# EAGLE schematic line_sensing (EAGLE 8.6.0)
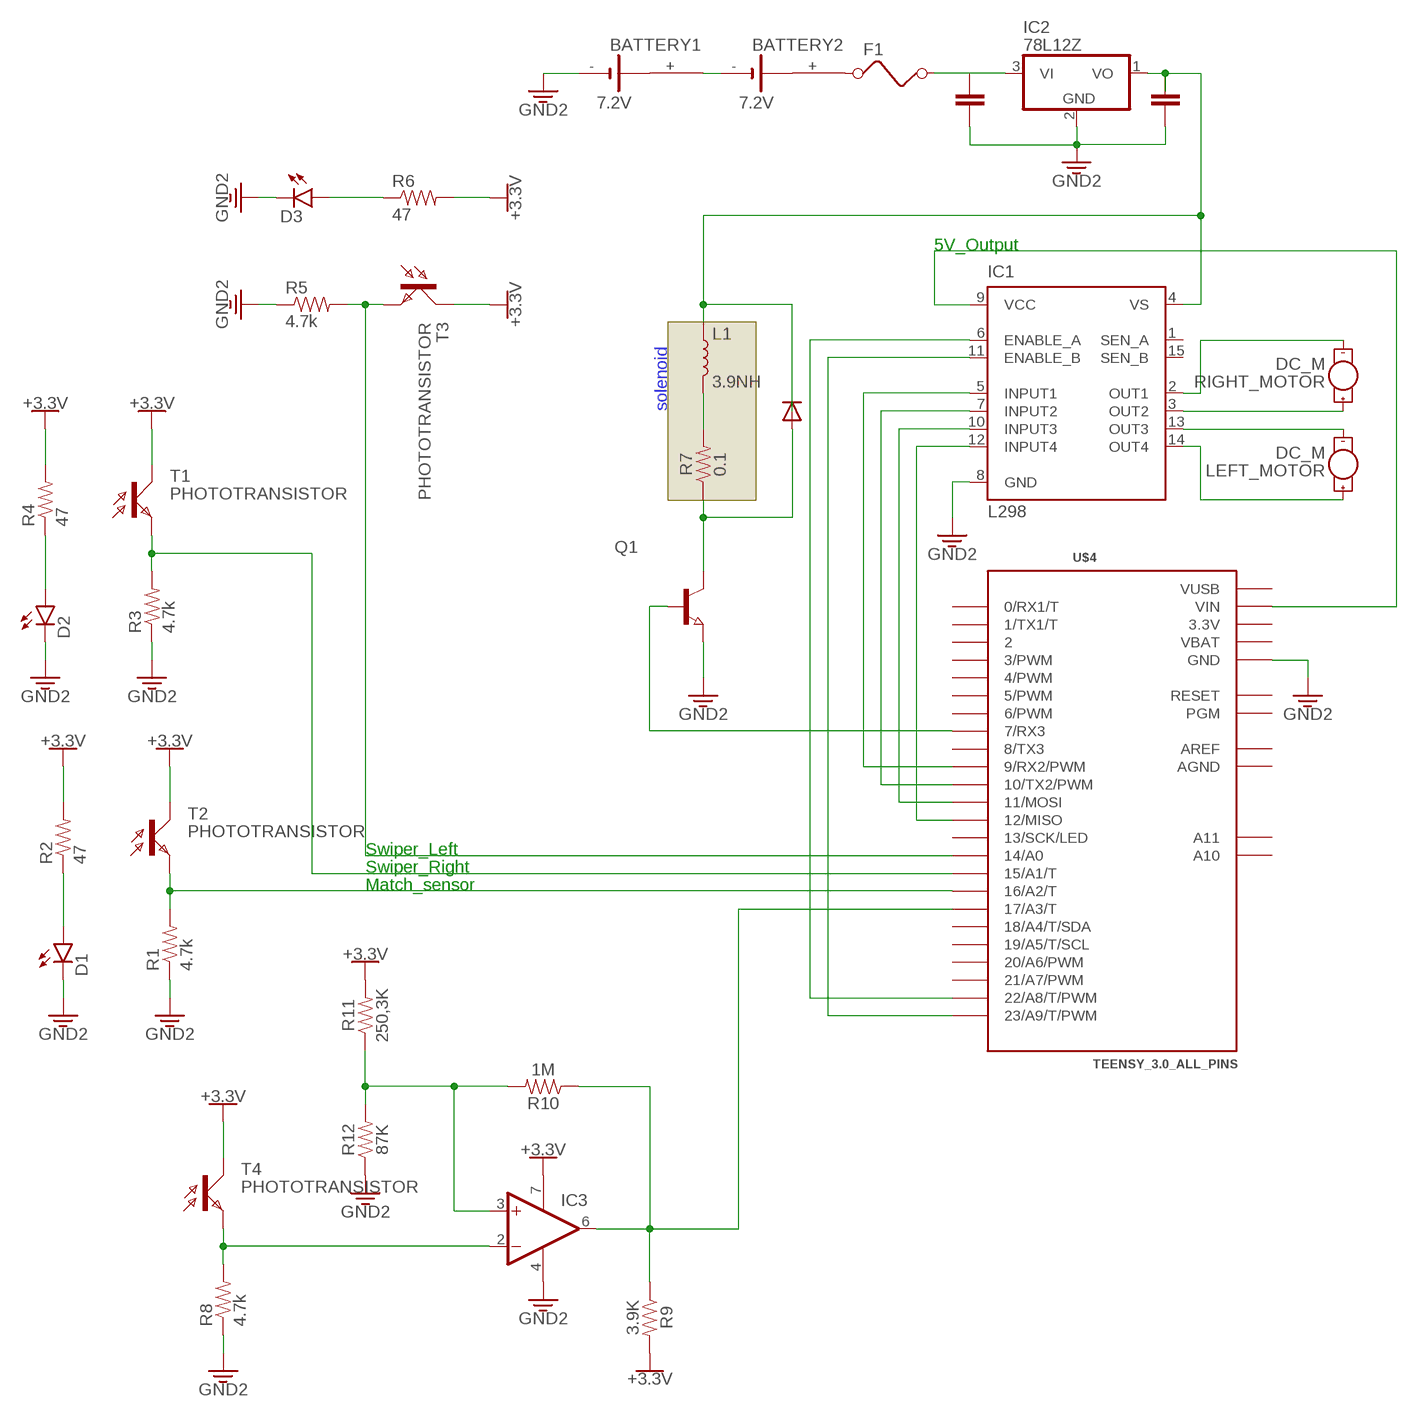
[diagram p0: schematic, sheet 1]

## Parts
BATTERY1  7.2V  B2430UNI  [B2430UNI]
BATTERY2  7.2V  B2430UNI  [B2430UNI]
D1  LED-3MM-NO_SILK  [LED3MM-NS]
D2  LED-3MM-NO_SILK  [LED3MM-NS]
D3  LED-3MM-NO_SILK  [LED3MM-NS]
F1  FUSE  [FUSE]
IC1  L298  [MULTIWATT-15]
IC2  78L12Z  [TO92]
IC3  1AMP_P7+4D  [SO08]
L1  3.9NH  INDUCTOR-0402-3.9NH  [0402]
LEFT_MOTOR  DC_M  MOTOR10MM  [VIBE-MOTOR-10MM]
Q1  NPN-TRANSISTOR_SOT89  [SOT89]
R1  4.7k  RESISTOR0402-RES  [0402-RES]
R2  47  RESISTOR0402-RES  [0402-RES]
R3  4.7k  RESISTOR0402-RES  [0402-RES]
R4  47  RESISTOR0402-RES  [0402-RES]
R5  4.7k  RESISTOR0402-RES  [0402-RES]
R6  47  RESISTOR0402-RES  [0402-RES]
R7  0.1  0.1OHM-1210-1/2W-1%  [1210]
R8  4.7k  RESISTOR0402-RES  [0402-RES]
R9  3.9K  0.1OHM-1210-1/2W-1%  [1210]
R10  1M  0.1OHM-1210-1/2W-1%  [1210]
R11  250,3K  0.1OHM-1210-1/2W-1%  [1210]
R12  87K  0.1OHM-1210-1/2W-1%  [1210]
RIGHT_MOTOR  DC_M  MOTOR10MM  [VIBE-MOTOR-10MM]
T1  PHOTOTRANSISTOR  [BPX81]
T2  PHOTOTRANSISTOR  [BPX81]
T3  PHOTOTRANSISTOR  [BPX81]
T4  PHOTOTRANSISTOR  [BPX81]
U$4  TEENSY_3.0_ALL_PINS  [TEENSY_3.0-3.2&LC_ALL_PINS]

## Nets
3.3V: BATTERY1.- D1.K(C) D2.K(C) D3.K(C) IC1.8(GND) IC2.2(GND) Q1.3(E) R1.1 R3.1 R5.1 R8.1 R12.1 U$4.GND U$4.GND1(GND) ; supply symbol labelled GND2
5V_OUTPUT: IC1.9(VCC) U$4.VIN
GND: R2.2 R4.2 R6.2 T1.C T2.C T3.C T4.C ; supply symbol labelled +3.3V
N$1: D1.A R2.1
N$2: R3.2 T1.E U$4.15/A1(15/A1/T)
N$3: D2.A R4.1
N$4: IC1.12(INPUT4) U$4.12(12/MISO)
N$5: IC3.6(OUT) R9.1 R10.1 U$4.17/A3(17/A3/T)
N$6: D3.A R6.1
N$7: IC1.10(INPUT3) U$4.11(11/MOSI)
N$8: IC1.7(INPUT2) U$4.10(10/TX2/PWM)
N$9: IC1.5(INPUT1) U$4.9(9/RX2/PWM)
N$10: IC1.4(VS) IC2.1(VO) L1.1
N$11: IC1.11(ENABLE_B) U$4.23/A9(23/A9/T/PWM)
N$12: IC1.6(ENABLE_A) U$4.22/A8(22/A8/T/PWM)
N$13: IC1.13(OUT3) LEFT_MOTOR.-
N$14: R1.2 T2.E U$4.16/A2(16/A2/T)
N$15: IC1.14(OUT4) LEFT_MOTOR.+
N$16: Q1.1(B) U$4.7(7/RX3)
N$17: F1.2 IC2.3(VI)
N$18: BATTERY1.+ BATTERY2.-
N$19: IC1.3(OUT2) RIGHT_MOTOR.+
N$20: IC1.2(OUT1) RIGHT_MOTOR.-
N$21: L1.2 R7.2
N$22: Q1.2(C) R7.1
N$23: IC3.2(-IN) R8.2 T4.E
N$24: R5.2 T3.E U$4.14/A0
N$25: BATTERY2.+ F1.1
N$26: IC3.3(+IN) R10.2 R11.1 R12.2
Unconnected: BATTERY1.+@1(+) BATTERY1.+@2(+) BATTERY1.+@3(+) BATTERY1.+@4(+) BATTERY1.-@1(-) BATTERY2.+@1(+) BATTERY2.+@2(+) BATTERY2.+@3(+) BATTERY2.+@4(+) BATTERY2.-@1(-) IC1.1(SEN_A) IC1.15(SEN_B) R9.2 R11.2 U$4.0(0/RX1/T) U$4.1(1/TX1/T) U$4.2 U$4.3(3/PWM) U$4.4(4/PWM) U$4.5(5/PWM) U$4.6(6/PWM) U$4.8(8/TX3) U$4.13(13/SCK/LED) U$4.18/A4(18/A4/T/SDA) U$4.19/A5(19/A5/T/SCL) U$4.20/A6(20/A6/PWM) U$4.21/A7(21/A7/PWM) U$4.A10 U$4.A11 U$4.PGM U$4.RESET/DAC(RESET)

## Notes on the sheet
- 5V_Output
- solenoid
- Swiper_Left
- Swiper_Right
- Match_sensor

## Power pins joined to a net without a drawn wire
3.3V: U$4.3.3V U$4.3.3V1(3.3V)
AGND: U$4.AGND
AREF: U$4.AREF
V+: IC3.7(V+)
V-: IC3.4(V-)
VBAT: U$4.VBAT
VUSB: U$4.VUSB

## Library data of the parts
BATTERY1 BATTERY2 = battery:B2430UNI: LI BATTERY
D1-D3 = ME210Lib_2015_v2p2:LED: LEDs Standard schematic elements and footprints for 5mm, 3mm, 1206, and 0603 sized LEDs. 5mm - Spark Fun Electronics SKU : COM-00529 (and others)
F1 = special:FUSE: FUSE 5 x 20 mm
IC1 = st-microelectronics:L298: DUAL FULL-BRIDGE DRIVER; MPN: L298N; OC_FARNELL: 1589425; OC_NEWARK: 32M1527
IC2 = linear:78*: Positive VOLTAGE REGULATOR Source: http://cache.national.com/ds/LM/LM78L05.pdf http://www.fairchildsemi.com/ds/LM/LM7805.pdf
IC3 = linear:1AMP_P7+4: OP AMP
L1 = SparkFun-Coils:INDUCTOR: Inductors Resist changes in electrical current. Basically a coil of wire. SparkFun Products: SparkFun Load Cell Amplifier - HX711 <https://www.sparkfun.com/products/13879> IOIO-OTG - V2.2 <https://www.sparkfun.com/products/13613>; PROD_ID: NDUC-13457
LEFT_MOTOR RIGHT_MOTOR = SparkFun-Electromechanical:MOTOR: Motor (Single-Phase) Two-terminal, single-phase motors. SparkFun Products Vibration Motor <https://www.sparkfun.com/products/8449> (ROB-08449) Physical dimension and wire connections for this powerful vibration motor. Motor has a self adhesive backing.; PROD_ID: COMP-08572; SF_SKU: ROB-08449
Q1 = semicon-smd-ipc:NPN-TRANSISTOR_: NPN TRANSISTOR
R1-R6 R8 = ME210Lib_2015_v2p2:RESISTOR: Resistor Basic schematic elements and footprints for 0603, 1206, and PTH resistors.
R7 = SparkFun-Resistors:0.1OHM: 0.1Ω resistor A resistor is a passive two-terminal electrical component that implements electrical resistance as a circuit element. Resistors act to reduce current flow, and, at the same time, act to lower voltage levels within circuits. - Wikipedia; PROD_ID: RES-12374
R9-R12 = SparkFun-Resistors:0.1OHM: 0.1Ω resistor A resistor is a passive two-terminal electrical component that implements electrical resistance as a circuit element. Resistors act to reduce current flow, and, at the same time, act to lower voltage levels within circuits. - Wikipedia; PROD_ID: RES-12374; VALUE: 0.1
T1-T4 = ME210Lib_2015_v2p2:PHOTOTRANSISTOR: PHOTO TRANSISTOR; OC_FARNELL: unknown; OC_NEWARK: unknown
U$4 = Teensy_3_and_LC_Series_Boards_v1.4:TEENSY_3.0_ALL_PINS: Teensy 3.0 board, showing all pins that are easily acessible.